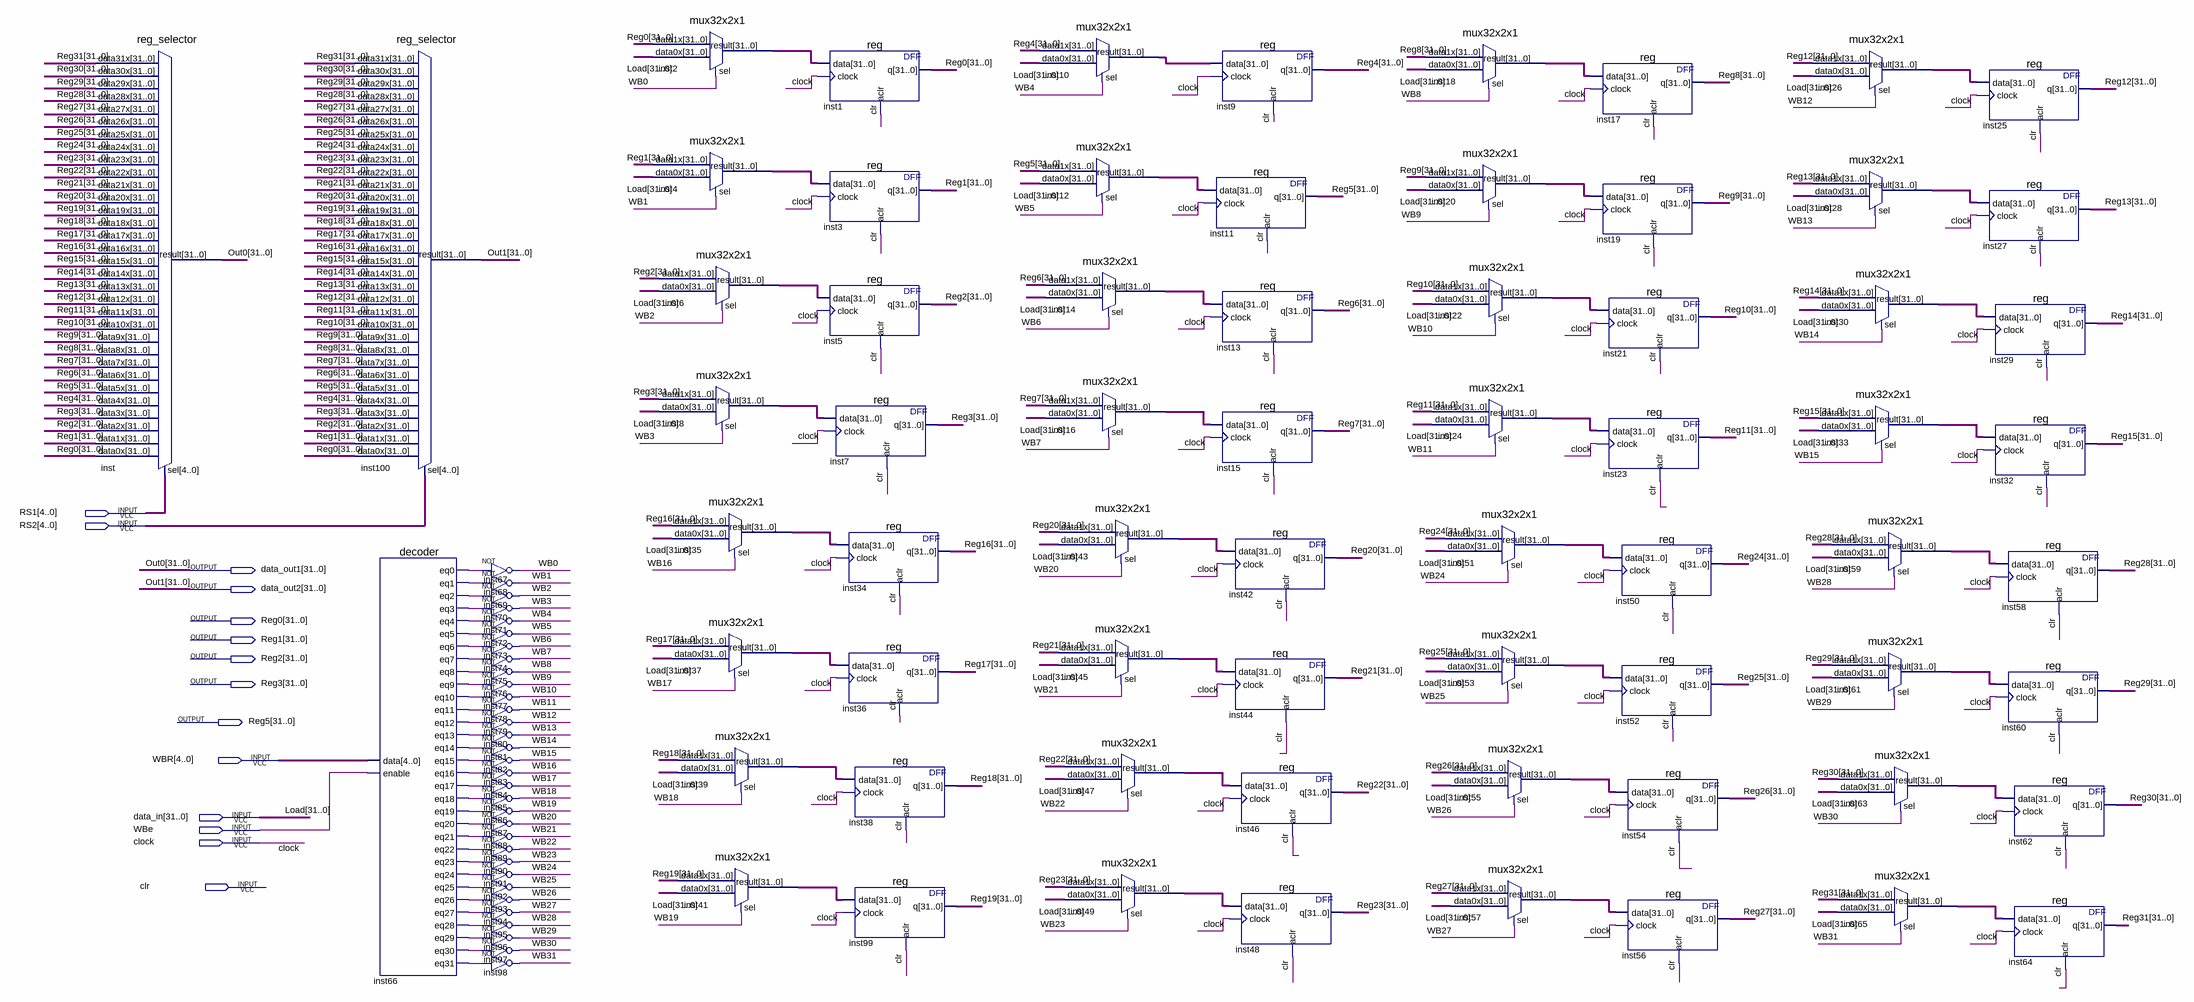
[diagram p0: schematic sheet]
// Quartus schematic Register_File.bdf as structural Verilog: 99 symbols, 14 pins
module Register_File (
  input  [4:0] RS1,
  input  [4:0] RS2,
  input  [4:0] WBR,
  input  [31:0] data_in,
  input  WBe,
  input  clock,
  input  clr,
  output [31:0] data_out1,
  output [31:0] data_out2,
  output [31:0] Reg0,
  output [31:0] Reg1,
  output [31:0] Reg2,
  output [31:0] Reg3,
  output [31:0] Reg5
);

  wire inst66_eq0, inst66_eq1, inst66_eq2, inst66_eq3, inst66_eq4, inst66_eq5, inst66_eq6, inst66_eq7,
       inst66_eq8, inst66_eq9, inst66_eq10, inst66_eq11, inst66_eq12, inst66_eq13, inst66_eq14, inst66_eq15,
       inst66_eq16, inst66_eq17, inst66_eq18, inst66_eq19, inst66_eq20, inst66_eq21, inst66_eq22,
       inst66_eq23, inst66_eq24, inst66_eq25, inst66_eq26, inst66_eq27, inst66_eq28, inst66_eq29,
       inst66_eq30, inst66_eq31, WB0, WB1, WB2, WB3, WB4, WB5, WB6, WB7, WB8, WB9, WB10, WB11, WB12, WB13,
       WB14, WB15, WB16, WB17, WB18, WB19, WB20, WB21, WB22, WB23, WB24, WB25, WB26, WB27, WB28, WB29, WB30,
       WB31;
  wire [31:0] inst2_result, inst4_result, inst6_result, inst8_result, inst10_result, inst12_result,
       inst14_result, inst16_result, inst18_result, inst20_result, inst22_result, inst24_result,
       inst26_result, inst28_result, inst30_result, inst33_result, inst35_result, inst37_result,
       inst39_result, inst41_result, inst43_result, inst45_result, inst47_result, inst49_result,
       inst51_result, inst53_result, inst55_result, inst57_result, inst59_result, inst61_result,
       inst63_result, inst65_result, Reg4, Reg6, Reg7, Reg8, Reg9, Reg10, Reg11, Reg12, Reg13, Reg14, Reg15,
       Reg16, Reg17, Reg18, Reg19, Reg20, Reg21, Reg22, Reg23, Reg24, Reg25, Reg26, Reg27, Reg28, Reg29,
       Reg30, Reg31;

  reg_selector inst (
    .data31x(Reg31), .data30x(Reg30), .data29x(Reg29), .data28x(Reg28), .data27x(Reg27), .data26x(Reg26),
    .data25x(Reg25), .data24x(Reg24), .data23x(Reg23), .data22x(Reg22), .data21x(Reg21), .data20x(Reg20),
    .data19x(Reg19), .data18x(Reg18), .data17x(Reg17), .data16x(Reg16), .data15x(Reg15), .data14x(Reg14),
    .data13x(Reg13), .data12x(Reg12), .data11x(Reg11), .data10x(Reg10), .data9x(Reg9), .data8x(Reg8),
    .data7x(Reg7), .data6x(Reg6), .data5x(Reg5), .data4x(Reg4), .data3x(Reg3), .data2x(Reg2), .data1x(Reg1),
    .data0x(Reg0), .sel(RS1), .result(data_out1));
  reg_selector inst100 (
    .data31x(Reg31), .data30x(Reg30), .data29x(Reg29), .data28x(Reg28), .data27x(Reg27), .data26x(Reg26),
    .data25x(Reg25), .data24x(Reg24), .data23x(Reg23), .data22x(Reg22), .data21x(Reg21), .data20x(Reg20),
    .data19x(Reg19), .data18x(Reg18), .data17x(Reg17), .data16x(Reg16), .data15x(Reg15), .data14x(Reg14),
    .data13x(Reg13), .data12x(Reg12), .data11x(Reg11), .data10x(Reg10), .data9x(Reg9), .data8x(Reg8),
    .data7x(Reg7), .data6x(Reg6), .data5x(Reg5), .data4x(Reg4), .data3x(Reg3), .data2x(Reg2), .data1x(Reg1),
    .data0x(Reg0), .sel(RS2), .result(data_out2));
  decoder inst66 (
    .data(WBR), .enable(WBe), .eq0(inst66_eq0), .eq1(inst66_eq1), .eq2(inst66_eq2), .eq3(inst66_eq3),
    .eq4(inst66_eq4), .eq5(inst66_eq5), .eq6(inst66_eq6), .eq7(inst66_eq7), .eq8(inst66_eq8),
    .eq9(inst66_eq9), .eq10(inst66_eq10), .eq11(inst66_eq11), .eq12(inst66_eq12), .eq13(inst66_eq13),
    .eq14(inst66_eq14), .eq15(inst66_eq15), .eq16(inst66_eq16), .eq17(inst66_eq17), .eq18(inst66_eq18),
    .eq19(inst66_eq19), .eq20(inst66_eq20), .eq21(inst66_eq21), .eq22(inst66_eq22), .eq23(inst66_eq23),
    .eq24(inst66_eq24), .eq25(inst66_eq25), .eq26(inst66_eq26), .eq27(inst66_eq27), .eq28(inst66_eq28),
    .eq29(inst66_eq29), .eq30(inst66_eq30), .eq31(inst66_eq31));
  not inst67 (WB0, inst66_eq0);
  not inst68 (WB1, inst66_eq1);
  not inst69 (WB2, inst66_eq2);
  not inst70 (WB3, inst66_eq3);
  not inst71 (WB4, inst66_eq4);
  not inst72 (WB5, inst66_eq5);
  not inst73 (WB6, inst66_eq6);
  not inst74 (WB7, inst66_eq7);
  not inst75 (WB8, inst66_eq8);
  not inst76 (WB9, inst66_eq9);
  not inst77 (WB10, inst66_eq10);
  not inst78 (WB11, inst66_eq11);
  not inst79 (WB12, inst66_eq12);
  not inst80 (WB13, inst66_eq13);
  not inst81 (WB14, inst66_eq14);
  not inst82 (WB15, inst66_eq15);
  not inst83 (WB16, inst66_eq16);
  not inst84 (WB17, inst66_eq17);
  not inst85 (WB18, inst66_eq18);
  not inst86 (WB19, inst66_eq19);
  not inst87 (WB20, inst66_eq20);
  not inst88 (WB21, inst66_eq21);
  not inst89 (WB22, inst66_eq22);
  not inst90 (WB23, inst66_eq23);
  not inst91 (WB24, inst66_eq24);
  not inst92 (WB25, inst66_eq25);
  not inst93 (WB26, inst66_eq26);
  not inst94 (WB27, inst66_eq27);
  not inst95 (WB28, inst66_eq28);
  not inst96 (WB29, inst66_eq29);
  not inst97 (WB30, inst66_eq30);
  not inst98 (WB31, inst66_eq31);
  mux32x2x1 inst2 (.data1x(Reg0), .data0x(data_in), .sel(WB0), .result(inst2_result));
  mux32x2x1 inst4 (.data1x(Reg1), .data0x(data_in), .sel(WB1), .result(inst4_result));
  mux32x2x1 inst6 (.data1x(Reg2), .data0x(data_in), .sel(WB2), .result(inst6_result));
  mux32x2x1 inst8 (.data1x(Reg3), .data0x(data_in), .sel(WB3), .result(inst8_result));
  mux32x2x1 inst35 (.data1x(Reg16), .data0x(data_in), .sel(WB16), .result(inst35_result));
  mux32x2x1 inst37 (.data1x(Reg17), .data0x(data_in), .sel(WB17), .result(inst37_result));
  mux32x2x1 inst39 (.data1x(Reg18), .data0x(data_in), .sel(WB18), .result(inst39_result));
  mux32x2x1 inst41 (.data1x(Reg19), .data0x(data_in), .sel(WB19), .result(inst41_result));
  \reg  inst1 (.data(inst2_result), .clock(clock), .aclr(clr), .q(Reg0));
  \reg  inst3 (.data(inst4_result), .clock(clock), .aclr(clr), .q(Reg1));
  \reg  inst5 (.data(inst6_result), .clock(clock), .aclr(clr), .q(Reg2));
  \reg  inst7 (.data(inst8_result), .clock(clock), .aclr(clr), .q(Reg3));
  \reg  inst34 (.data(inst35_result), .clock(clock), .aclr(clr), .q(Reg16));
  \reg  inst36 (.data(inst37_result), .clock(clock), .aclr(clr), .q(Reg17));
  \reg  inst38 (.data(inst39_result), .clock(clock), .aclr(clr), .q(Reg18));
  \reg  inst99 (.data(inst41_result), .clock(clock), .aclr(clr), .q(Reg19));
  mux32x2x1 inst10 (.data1x(Reg4), .data0x(data_in), .sel(WB4), .result(inst10_result));
  mux32x2x1 inst12 (.data1x(Reg5), .data0x(data_in), .sel(WB5), .result(inst12_result));
  mux32x2x1 inst14 (.data1x(Reg6), .data0x(data_in), .sel(WB6), .result(inst14_result));
  mux32x2x1 inst16 (.data1x(Reg7), .data0x(data_in), .sel(WB7), .result(inst16_result));
  mux32x2x1 inst43 (.data1x(Reg20), .data0x(data_in), .sel(WB20), .result(inst43_result));
  mux32x2x1 inst45 (.data1x(Reg21), .data0x(data_in), .sel(WB21), .result(inst45_result));
  mux32x2x1 inst47 (.data1x(Reg22), .data0x(data_in), .sel(WB22), .result(inst47_result));
  mux32x2x1 inst49 (.data1x(Reg23), .data0x(data_in), .sel(WB23), .result(inst49_result));
  \reg  inst9 (.data(inst10_result), .clock(clock), .aclr(clr), .q(Reg4));
  \reg  inst11 (.data(inst12_result), .clock(clock), .aclr(clr), .q(Reg5));
  \reg  inst13 (.data(inst14_result), .clock(clock), .aclr(clr), .q(Reg6));
  \reg  inst15 (.data(inst16_result), .clock(clock), .aclr(clr), .q(Reg7));
  \reg  inst42 (.data(inst43_result), .clock(clock), .aclr(clr), .q(Reg20));
  \reg  inst44 (.data(inst45_result), .clock(clock), .aclr(clr), .q(Reg21));
  \reg  inst46 (.data(inst47_result), .clock(clock), .aclr(clr), .q(Reg22));
  \reg  inst48 (.data(inst49_result), .clock(clock), .aclr(clr), .q(Reg23));
  mux32x2x1 inst18 (.data1x(Reg8), .data0x(data_in), .sel(WB8), .result(inst18_result));
  mux32x2x1 inst20 (.data1x(Reg9), .data0x(data_in), .sel(WB9), .result(inst20_result));
  mux32x2x1 inst22 (.data1x(Reg10), .data0x(data_in), .sel(WB10), .result(inst22_result));
  mux32x2x1 inst24 (.data1x(Reg11), .data0x(data_in), .sel(WB11), .result(inst24_result));
  mux32x2x1 inst51 (.data1x(Reg24), .data0x(data_in), .sel(WB24), .result(inst51_result));
  mux32x2x1 inst53 (.data1x(Reg25), .data0x(data_in), .sel(WB25), .result(inst53_result));
  mux32x2x1 inst55 (.data1x(Reg26), .data0x(data_in), .sel(WB26), .result(inst55_result));
  mux32x2x1 inst57 (.data1x(Reg27), .data0x(data_in), .sel(WB27), .result(inst57_result));
  \reg  inst17 (.data(inst18_result), .clock(clock), .aclr(clr), .q(Reg8));
  \reg  inst19 (.data(inst20_result), .clock(clock), .aclr(clr), .q(Reg9));
  \reg  inst21 (.data(inst22_result), .clock(clock), .aclr(clr), .q(Reg10));
  \reg  inst23 (.data(inst24_result), .clock(clock), .aclr(clr), .q(Reg11));
  \reg  inst50 (.data(inst51_result), .clock(clock), .aclr(clr), .q(Reg24));
  \reg  inst52 (.data(inst53_result), .clock(clock), .aclr(clr), .q(Reg25));
  \reg  inst54 (.data(inst55_result), .clock(clock), .aclr(clr), .q(Reg26));
  \reg  inst56 (.data(inst57_result), .clock(clock), .aclr(clr), .q(Reg27));
  mux32x2x1 inst26 (.data1x(Reg12), .data0x(data_in), .sel(WB12), .result(inst26_result));
  mux32x2x1 inst28 (.data1x(Reg13), .data0x(data_in), .sel(WB13), .result(inst28_result));
  mux32x2x1 inst30 (.data1x(Reg14), .data0x(data_in), .sel(WB14), .result(inst30_result));
  mux32x2x1 inst33 (.data1x(Reg15), .data0x(data_in), .sel(WB15), .result(inst33_result));
  mux32x2x1 inst59 (.data1x(Reg28), .data0x(data_in), .sel(WB28), .result(inst59_result));
  mux32x2x1 inst61 (.data1x(Reg29), .data0x(data_in), .sel(WB29), .result(inst61_result));
  mux32x2x1 inst63 (.data1x(Reg30), .data0x(data_in), .sel(WB30), .result(inst63_result));
  mux32x2x1 inst65 (.data1x(Reg31), .data0x(data_in), .sel(WB31), .result(inst65_result));
  \reg  inst25 (.data(inst26_result), .clock(clock), .aclr(clr), .q(Reg12));
  \reg  inst27 (.data(inst28_result), .clock(clock), .aclr(clr), .q(Reg13));
  \reg  inst29 (.data(inst30_result), .clock(clock), .aclr(clr), .q(Reg14));
  \reg  inst32 (.data(inst33_result), .clock(clock), .aclr(clr), .q(Reg15));
  \reg  inst58 (.data(inst59_result), .clock(clock), .aclr(clr), .q(Reg28));
  \reg  inst60 (.data(inst61_result), .clock(clock), .aclr(clr), .q(Reg29));
  \reg  inst62 (.data(inst63_result), .clock(clock), .aclr(clr), .q(Reg30));
  \reg  inst64 (.data(inst65_result), .clock(clock), .aclr(clr), .q(Reg31));

  // Other names for the same wires on the sheet: Load[31:0] = data_in; Out0[31:0] = data_out1; Out1[31:0] = data_out2
endmodule
